# EAGLE design Lokalizator.GPS.GSM_Michał.Figołuszka (EAGLE 9.6.2)
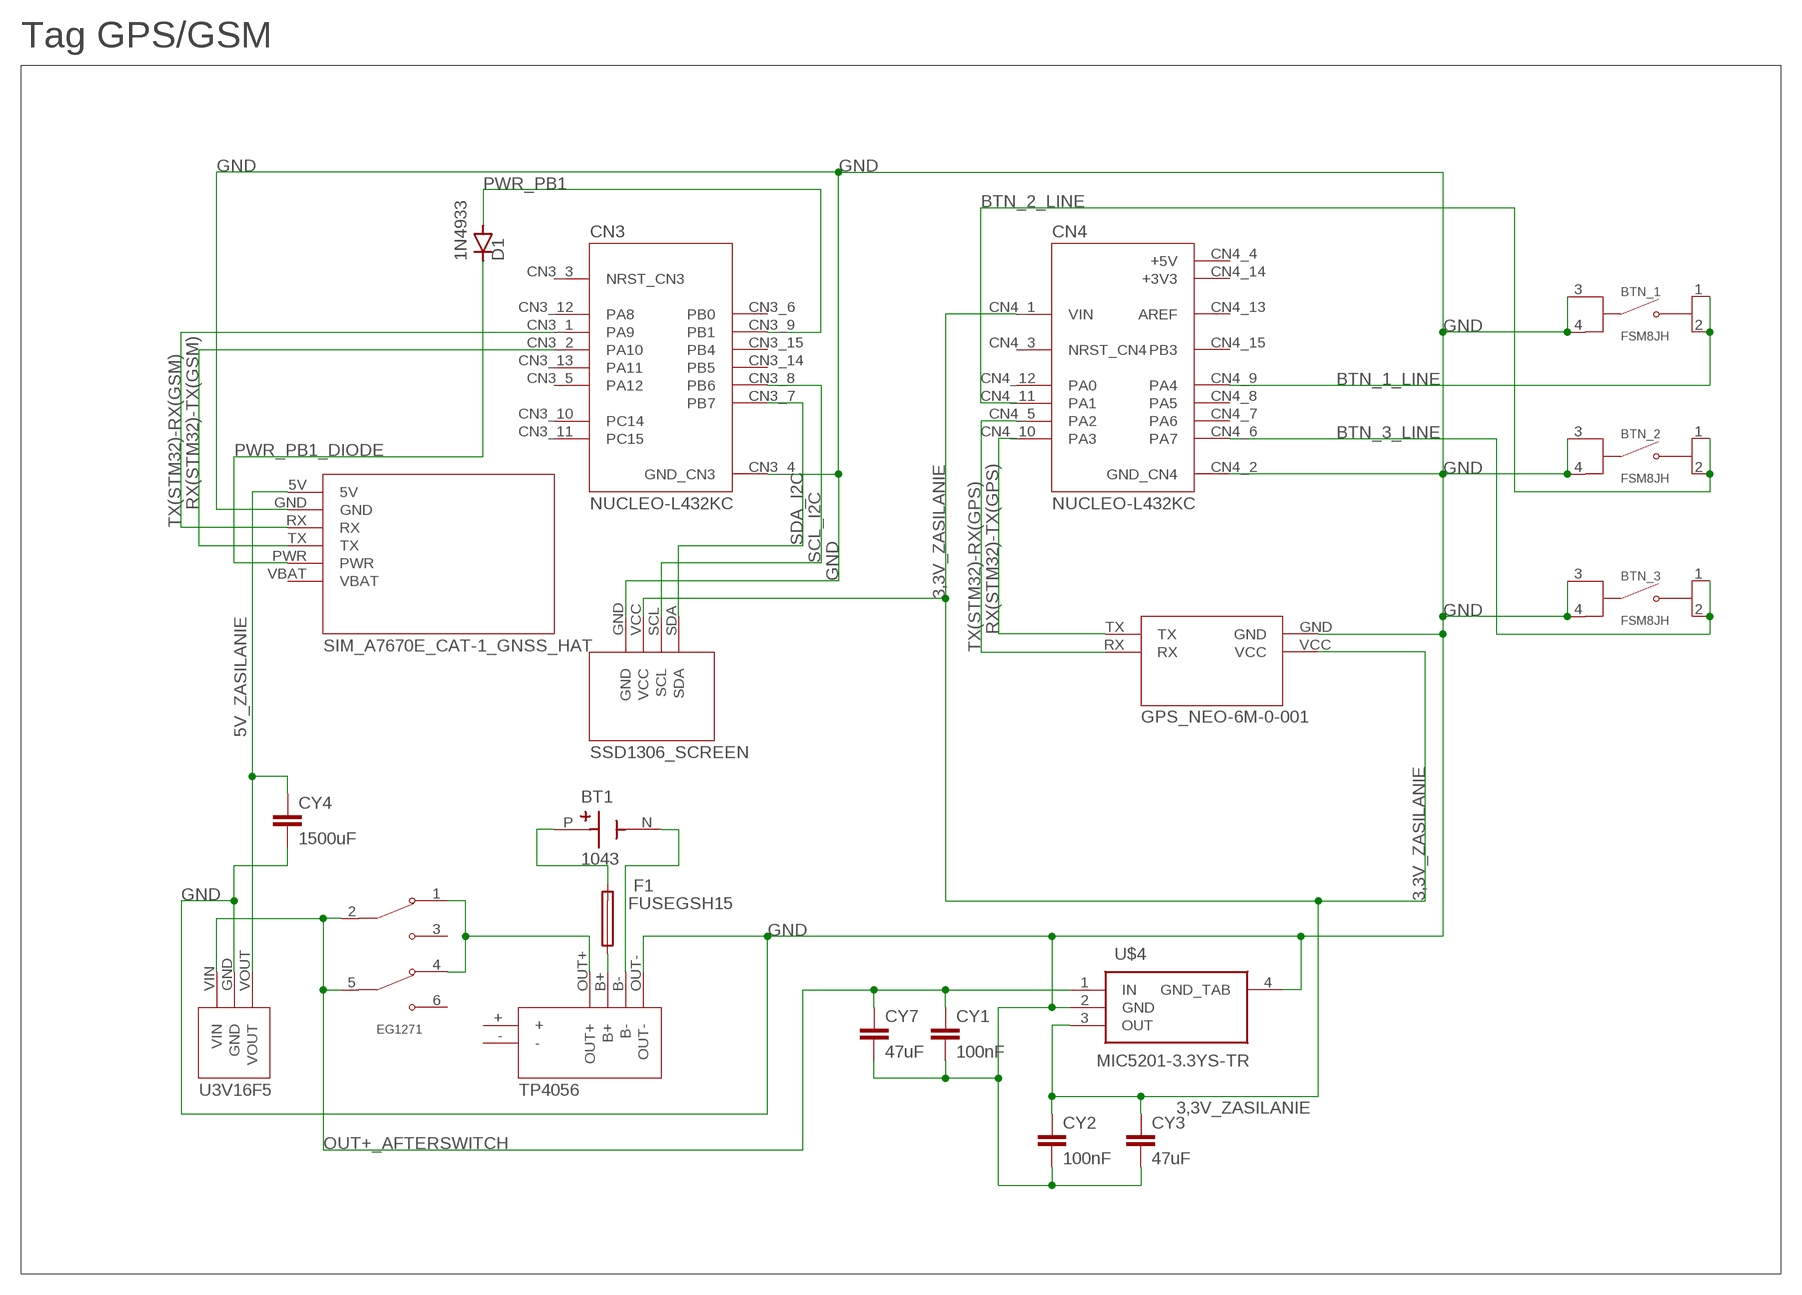
[diagram p0: schematic, sheet 1]

## Parts
BT1  1043  [BAT_1043]
BTN_1  FSM8JH  [SW_FSM8JH]
BTN_2  FSM8JH  [SW_FSM8JH]
BTN_3  FSM8JH  [SW_FSM8JH]
CY1  100nF  CYYC7B5  [YC7B5]
CY2  100nF  CYYC7B5  [YC7B5]
CY3  47uF  CYYC7B5  [YC7B5]
CY4  1500uF  CYYC7B5  [YC7B5]
CY7  47uF  CYYC7B5  [YC7B5]
D1  1N4933  [DO41-10]
F1  FUSEGSH15  [GSH15]
S1  EG1271  [SW_EG1271]
U1  NUCLEO-L432KC  [MODULE_NUCLEO-L432KC]
U$1  U3V16F5  [U3V16F5]
U$2  TP4056  [TP4056]
U$3  SSD1306_SCREEN  [SSD1306_SCREEN]
U$4  MIC5201-3.3YS-TR  [SOT230P700X180-4N]
U$6  SIM7020E_NB-IOT_HAT  [SIM7020E_NB-IOT_HAT]
U$7  GPS_NEO-6M-0-001  [GPS_NEO-6M-0-001]

## Nets
3,3V_ZASILANIE: CY2.1 CY3.1 U1.CN4_1(VIN) U$3.VCC U$4.3(OUT) U$7.VCC
5V_ZASILANIE: CY4.1 U$1.VOUT U$6.5V
B+: BT1.P(POS) F1.2
B+_2: F1.1 U$2.B+
B-: BT1.N(NEG) U$2.B-
BTN_1_LINE: BTN_1.1(NO_1) BTN_1.2(NO_2) U1.CN4_9(PA4)
BTN_2_LINE: BTN_2.1(NO_1) BTN_2.2(NO_2) U1.CN4_11(PA1)
BTN_3_LINE: BTN_3.1(NO_1) BTN_3.2(NO_2) U1.CN4_6(PA7)
GND: BTN_1.3(COM_3) BTN_1.4(COM_4) BTN_2.3(COM_3) BTN_2.4(COM_4) BTN_3.3(COM_3) BTN_3.4(COM_4) CY1.2 CY2.2 CY3.2 CY4.2 CY7.2 U1.CN3_4(GND_CN3) U1.CN4_2(GND_CN4) U$1.GND U$2.OUT- U$3.GND U$4.2(GND) U$4.4(GND_TAB) U$6.GND U$7.GND
OUT+: S1.1(NC1) S1.4(NC2) U$2.OUT+
OUT+_AFTERSWITCH: CY1.1 CY7.1 S1.2(COM1) S1.5(COM2) U$1.VIN U$4.1(IN)
PWR_PB1: D1.A U1.CN3_9(PB1)
PWR_PB1_DIODE: D1.C U$6.PWR
RX(STM32)-TX(GPS): U1.CN4_10(PA3) U$7.TX
RX(STM32)-TX(GSM): U1.CN3_2(PA10) U$6.TX
SCL_I2C: U1.CN3_8(PB6) U$3.SCL
SDA_I2C: U1.CN3_7(PB7) U$3.SDA
TX(STM32)-RX(GPS): U1.CN4_5(PA2) U$7.RX
TX(STM32)-RX(GSM): U1.CN3_1(PA9) U$6.RX
Unconnected: S1.3(NO1) S1.6(NO2) U1.CN3_3(NRST_CN3) U1.CN3_5(PA12) U1.CN3_6(PB0) U1.CN3_10(PC14) U1.CN3_11(PC15) U1.CN3_12(PA8) U1.CN3_13(PA11) U1.CN3_14(PB5) U1.CN3_15(PB4) U1.CN4_3(NRST_CN4) U1.CN4_7(PA6) U1.CN4_8(PA5) U1.CN4_12(PA0) U1.CN4_13(AREF) U1.CN4_15(PB3) U$2.+ U$2.- U$6.VBAT

## Notes on the sheet
- Tag GPS/GSM

## Power pins joined to a net without a drawn wire
+3V3: U1.CN4_14(+3V3)
+5V: U1.CN4_4(+5V)

## Library data of the parts
BT1 = holder_1043:1043: Check availability <https://pricing.snapeda.com/parts/1043/Keystone%20Electronics/view-part?ref=eda>; AVAILABILITY: In Stock; CHECK_PRICES: https://www.snapeda.com/parts/1043/Keystone/view-part/?ref=eda; DESCRIPTION: THM Holder for 18650 Battery; MF: Keystone Electronics; MP: 1043; PACKAGE: NON STANDARD-5 Keystone; PRICE: None; SNAPEDA_LINK: https://www.snapeda.com/parts/1043/Keystone/view-part/?ref=snap
BTN_1-BTN_3 = FSM8JH_button:FSM8JH: Check availability <https://pricing.snapeda.com/parts/FSM8JH/TE%20Connectivity/view-part?ref=eda>; AVAILABILITY: In Stock; CHECK_PRICES: https://www.snapeda.com/parts/FSM8JH/TE+Connectivity+Alcoswitch+Switches/view-part/?ref=eda; DESCRIPTION: Switch,Pushbutton,Tactile,SPST,Thru Hole,Vertical,6MM,Black | TE Connectivity FSM8JH; MF: TE Connectivity; MP: FSM8JH; PACKAGE: None; PRICE: None; SNAPEDA_LINK: https://www.snapeda.com/parts/FSM8JH/TE+Connectivity+Alcoswitch+Switches/view-part/?ref=snap
CY1-CY4 CY7 = rcl:CY: Y CAPACITOR for power line; SPICEPREFIX: C
D1 = diode:1N4933: DIODE fast recovery rectifier, 1A
F1 = fuse:FUSE: Fuse; OC_FARNELL: unknown; OC_NEWARK: unknown
S1 = EG1271_switch:EG1271: Check availability <https://pricing.snapeda.com/parts/EG1271/E-Switch/view-part?ref=eda>; AVAILABILITY: In Stock; CHECK_PRICES: https://www.snapeda.com/parts/EG1271/E-Switch/view-part/?ref=eda; DESCRIPTION: Slide Switch SPDT Through Hole; MF: E-Switch; MP: EG1271; PACKAGE: None; PRICE: None; SNAPEDA_LINK: https://www.snapeda.com/parts/EG1271/E-Switch/view-part/?ref=snap
U1 = NUCLEO-L432KC:NUCLEO-L432KC: Check availability <https://pricing.snapeda.com/parts/NUCLEO-L432KC/STMicroelectronics/view-part?ref=eda>; AVAILABILITY: In Stock; CHECK_PRICES: https://www.snapeda.com/parts/NUCLEO-L432KC/STMicroelectronics/view-part/?ref=eda; DESCRIPTION: STM32L432KC, mbed-Enabled Development Nucleo-32 STM32L4 ARM® Cortex®-M4 MCU 32-Bit Embedded Evaluation Board; MF: STMicroelectronics; MP: NUCLEO-L432KC; PACKAGE: None; PRICE: None; SNAPEDA_LINK: https://www.snapeda.com/parts/NUCLEO-L432KC/STMicroelectronics/view-part/?ref=snap
U$1 = U3V16F5:U3V16F5
U$2 = TP4056:TP4056
U$3 = SSD1306_SCREEN:SSD1306_SCREEN
U$4 = MIC5201-3.3YS-TR:MIC5201-3.3YS-TR
U$6 = SIM_A7670E_CAT-1_GNSS_HAT:SIM7020E_NB-IOT_HAT
U$7 = GPS_NEO-6M-0-001:GPS_NEO-6M-0-001

## Board
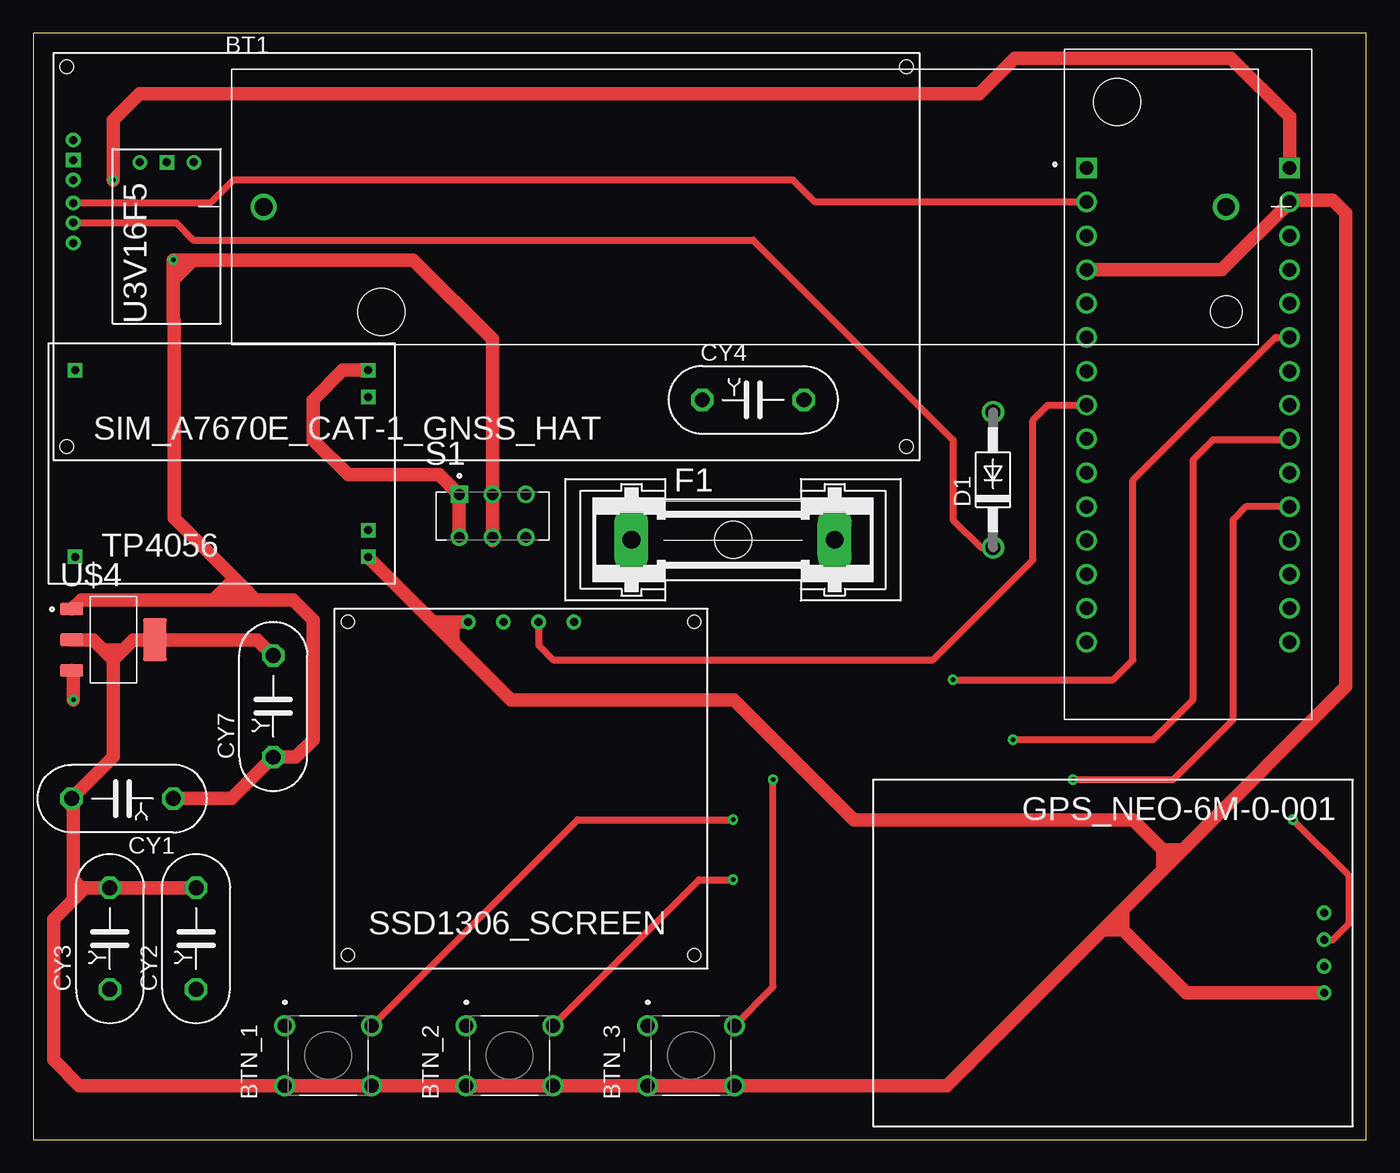
[diagram p1: board, top side]
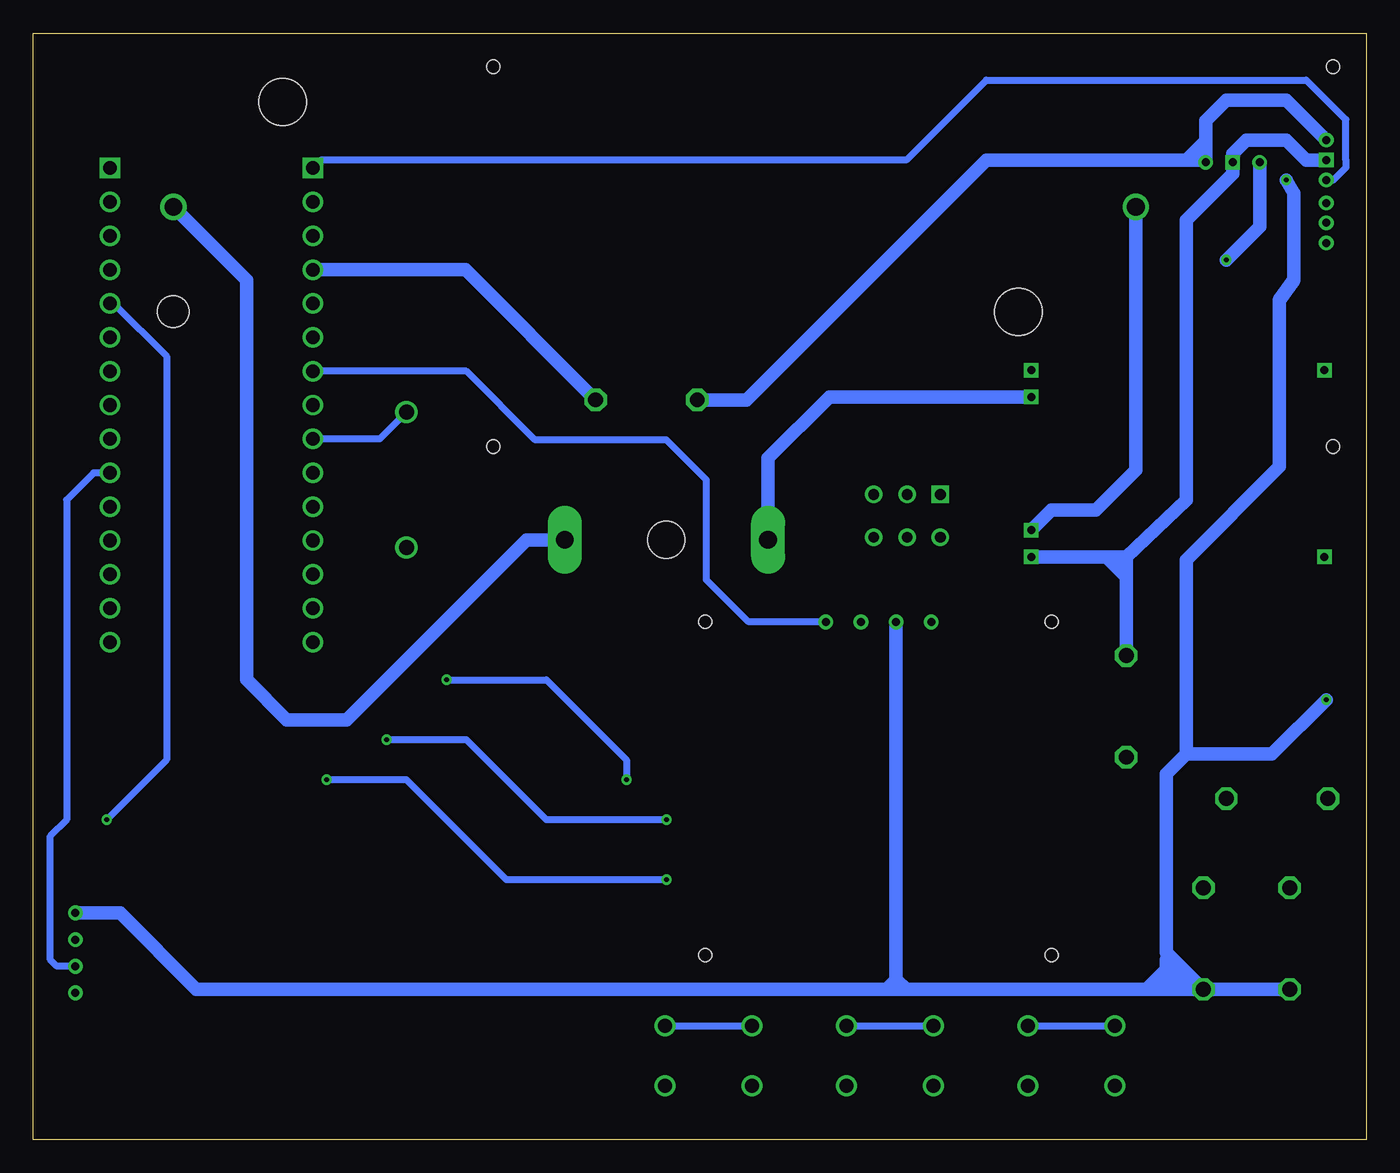
[diagram p2: board, bottom side, seen from below]

Size 100 x 83 mm. Coordinates in mm from the lower left corner, seen from the top.
Outline: 0,0 100,0 100,83 0,83 0,0
Copper layers (1*16): Top 0.035mm / dielectric 1.5mm / Bottom 0.035mm
Design rules "default": minimum track width 6mil, minimum drill 0.35mm, track to track 6mil, track to pad 6mil, pad to pad 6mil, via to via 6mil, smd to smd 6mil, copper to edge 40mil, drill to drill 6mil, minimum pad ring 10mil, minimum via ring 8mil, stop-mask expansion 4mil, vias tented up to drill 0mil, thermal gap 10mil

### Footprints (pad centres in the part's own frame; a part is rotated, then mirrored left to right if it is on the bottom)
BAT_1043 = drill 1.32: N -36.11,0; P 36.11,0 | hole 3.55: 27.91,7.87; -27.29,-7.87 | hole 2.39: 36.11,-7.87
SW_FSM8JH = drill 1.05: 1 2.25,3.25; 2 2.25,-3.25; 3 -2.25,3.25; 4 -2.25,-3.25
YC7B5 = drill 1.118 octagon: 1 -3.81,0; 2 3.81,0
DO41-10 = drill 1.118: A 5.08,0; C -5.08,0
GSH15 = drill 1.321 pad 2.54 long: 1 -7.62,0; 2 7.62,0 | hole 2.794: 0,0
SW_EG1271 = drill 0.8 square: 1 -2.5,1.6 | drill 0.8: 2 0,1.6; 3 2.5,1.6; 4 -2.5,-1.6; 5 0,-1.6; 6 2.5,-1.6
MODULE_NUCLEO-L432KC = drill 1.02 square: CN3_1 -7.62,16.215; CN4_1 7.62,16.215 | drill 1.02: CN3_2 -7.62,13.675; CN3_3 -7.62,11.135; CN3_4 -7.62,8.595; CN3_5 -7.62,6.055; CN3_6 -7.62,3.515; CN3_7 -7.62,0.975; CN3_8 -7.62,-1.565; CN3_9 -7.62,-4.105; CN3_10 -7.62,-6.645; CN3_11 -7.62,-9.185; CN3_12 -7.62,-11.725; CN3_13 -7.62,-14.265; CN3_14 -7.62,-16.805; CN3_15 -7.62,-19.345; CN4_2 7.62,13.675; CN4_3 7.62,11.135; CN4_4 7.62,8.595; CN4_5 7.62,6.055; CN4_6 7.62,3.515; CN4_7 7.62,0.975; CN4_8 7.62,-1.565; CN4_9 7.62,-4.105; CN4_10 7.62,-6.645; CN4_11 7.62,-9.185; CN4_12 7.62,-11.725; CN4_13 7.62,-14.265; CN4_14 7.62,-16.805; CN4_15 7.62,-19.345
U3V16F5 = drill 0.6 square: GND 4.05,12.1 | drill 0.6: VIN 2.025,12.1; VOUT 6.075,12.1
TP4056 = drill 0.6 square: + 2,16; - 2,2; B+ 24,14; B- 24,4; OUT+ 24,16; OUT- 24,2
SSD1306_SCREEN = drill 0.6: GND 10.04,26; SCL 15.32,26; SDA 17.96,26; VCC 12.68,26 | hole 1: 1,26; 27,26; 27,1; 1,1
SOT230P700X180-4N = smd 1.76 x 0.93: 1 -3.125,2.3; 2 -3.125,0; 3 -3.125,-2.3 | smd 1.76 x 3.19: 4 3.125,0
SIM7020E_NB-IOT_HAT = drill 0.6: 5V 1.5,24; PWR 1.5,17.78; RX 1.5,21; TX 1.5,19.27; VBAT 1.5,16.27 | drill 0.6 square: GND 1.5,22.5 | hole 1: 1,29.5; 64,29.5; 64,1; 1,1
GPS_NEO-6M-0-001 = drill 0.6: GND 2.16,16; RX 2.16,12; TX 2.16,14; VCC 2.16,10

### Placement (x,y rotation side)
BT1  53.39,69.98 0 top
BTN_1  22.12,6.3 90 top
BTN_2  35.73,6.3 90 top
BTN_3  49.34,6.3 90 top
CY1  6.68,25.58 180 top
CY2  12.21,15.08 90 top
CY3  5.74,15.08 90 top
CY4  54,55.5 0 top
CY7  18,32.5 90 top
D1  72,49.5 90 top
F1  52.5,45 0 top
S1  34.45,46.8 0 top
U1  86.64,56.67 0 top
U$1  5.97,61.22 0 top
U$2  1.13,41.72 0 top
U$3  22.59,12.84 0 top
U$4  6,37.5 0 top
U$6  1.5,51 0 top
U$7  99,27 180 top

### Tracks (layer width: path | path; a pad name or v marks a point on that pad's centre or on a via)
3,3V_ZASILANIE  (via drill 0.35)
  Top 1.016: U1.CN4_1 94.26,76.74 89.85,81.15 73.65,81.15 70.98,78.48 7.98,78.48 6,76.5 v6,72 | U$4.3 3,35.08 v3,33
  Bottom 1.016: 13.5,28.93 7.07,28.93 v3,33 | v6,72 5.42,71.02 5.42,64.5 6.52,63 6.52,50.48 13.5,43.5 13.5,28.93 | CY2.1 CY3.1 | U$7.VCC 93.5,17 87.77,11.27 36,11.27 | CY2.1 13.5,11.27 | 14.27,11.27 15,11.27 | 34.5,11.27 16.5,11.27 | 15.73,11.27 15,11.27 | 34.5,11.27 36,11.27 | 13.5,28.93 15,27.43 15,14.06 14.72,13.78 | CY2.1 13.22,12.28 | 14.72,13.78 13.97,13.03 | 13.97,13.03 13.22,12.28 | U$3.VCC 35.27,12 | 35.27,12 36,11.27 | 34.5,11.27 35.23,12 35.27,12 | 13.22,12.28 13.5,12 | 13.5,11.27 13.5,12 | 14.72,13.78 15,13.5 | 15,12.77 15,12 | 13.97,13.03 15,12 | 15,12 15,11.27 | 14.27,11.27 14.23,11.27 | 14.23,11.27 13.5,12 | 13.5,11.27 14.23,11.27 | 14.27,11.27 15,12 | 15,13.5 13.5,12 | 13.5,12 15,12 | 15,12 15.73,11.27 | 15.73,11.27 16.5,11.27 | 16.5,11.27 15,12.77 | 15,12.77 15,13.5
5V_ZASILANIE
  Bottom 1.016: U$6.5V 6,78 10.5,78 12.04,76.45 12.04,75 12.04,74.95 | 12.04,74.95 U$1.VOUT 12.22,73.5 13.5,73.5 | CY4.1 46.5,55.5 28.5,73.5 13.5,73.5 | 13.5,73.5 12.04,74.95
B+
  Bottom 1.016: BT1.P 84.01,64.49 84.01,34.51 81,31.5 76.5,31.5 63,45 F1.2
B+_2
  Bottom 1.016: U$2.B+ 40.28,55.72 44.88,51.12 F1.1
B-
  Bottom 1.016: BT1.N 17.28,50.22 20.28,47.22 23.63,47.22 U$2.B-
BTN_1_LINE  (via drill 0.35)
  Top 0.508: U1.CN4_9 94.19,52.5 88.5,52.5 87,51 87,33 84,30 v73.5,30 | BTN_1.2 40.82,24 v52.5,24
  Bottom 0.508: BTN_1.2 BTN_1.1 | v73.5,30 67.5,30 61.5,24 v52.5,24
BTN_2_LINE  (via drill 0.35)
  Top 0.508: U1.CN4_11 90.98,47.48 90,46.5 90,31.5 85.5,27 v78,27 | BTN_2.2 49.93,19.5 v52.5,19.5
  Bottom 0.508: BTN_2.2 BTN_2.1 | v78,27 72,27 64.5,19.5 v52.5,19.5
BTN_3_LINE  (via drill 0.35)
  Top 0.508: v69,34.5 81,34.5 82.5,36 82.5,49.5 93.19,60.19 U1.CN4_6 | BTN_3.2 55.5,11.46 v55.5,27
  Bottom 0.508: BTN_3.2 BTN_3.1 | v69,34.5 61.5,34.5 55.5,28.5 v55.5,27
GND
  Top 1.016: 3,19.5 3,25.45 CY1.2 6,28.71 6,36 | 3,19.5 3.61,18.89 3.89,18.89 | 3.89,18.89 CY3.2 CY2.2 | U1.CN3_4 89.18,65.27 U1.CN4_2 94.42,70.5 97.5,70.5 98.48,69.52 98.48,33.98 86.25,21.75 | 6,36 5.25,36.75 | 5.25,36.75 4.5,37.5 U$4.2 | 6,36 6.75,36.75 | 6.75,36.75 7.5,37.5 U$4.4 16.81,37.5 CY7.2 | 80.25,15.75 68.55,4.05 BTN_3.4 BTN_3.3 BTN_2.4 BTN_2.3 BTN_1.4 BTN_1.3 3.45,4.05 1.52,5.98 1.52,16.52 3,18 | 80.25,15.75 81,16.5 | 81,16.5 81.75,17.25 | 81.75,17.25 84.75,20.25 | 84.75,20.25 85.5,21 | 85.5,21 86.25,21.75 | U$7.GND 86.5,11 81.75,15.75 | 81.75,15.75 81,16.5 | 81.75,15.75 81.75,17.25 | 80.25,15.75 81.75,15.75 | 3,19.5 3,18 | 3,18 3.89,18.89 | U$2.OUT- 30.01,38.84 | 30.01,38.84 31.5,38.84 | 31.5,38.84 U$3.GND | 84.75,21.75 82.5,24 61.57,24 52.57,33 35.85,33 31.43,37.42 | 85.5,21 84.75,21.75 | 84.75,21.75 86.25,21.75 | 84.75,21.75 84.75,20.25 | 30.01,38.84 31.43,37.42 | 31.5,38.84 31.5,37.5 31.43,37.42 | 5.25,36.75 6.75,36.75
  Bottom 1.016: 18,43.7 13.5,48 13.5,69 10.02,72.48 U$1.GND 10.02,73.98 9,75 6,75 4.5,73.5 U$6.GND | 18,43.7 19.5,43.7 | 19.5,43.7 24.91,43.7 U$2.OUT- | CY4.2 67.58,65.27 U1.CN3_4 | CY7.2 18,42 18,42.2 | 18,42.2 18,43.7 | 19.5,43.7 18,42.2
OUT+
  Top 1.016: U$2.OUT+ 23.22,57.72 21,55.5 21,52.5 23.6,49.9 30.45,49.9 S1.1 S1.4
OUT+_AFTERSWITCH  (via drill 0.35)
  Top 1.016: 12,66 28.5,66 34.45,60.05 S1.2 S1.5 34.45,44.95 | 10.5,64.5 10.5,61.5 10.57,61.43 10.57,46.62 15.1,42.09 | 12,66 10.5,64.5 | 10.5,64.5 v10.5,66 12,66 | 15.85,41.34 16.69,40.5 | 15.85,41.34 15.1,42.09 | U$4.1 3.58,40.5 13.5,40.5 | 13.5,40.5 15,40.5 | 15.1,40.59 15.85,41.34 | 15,40.5 16.69,40.5 | CY1.1 14.89,25.58 CY7.1 19.69,28.69 21,30 21,39 19.5,40.5 16.69,40.5 | 15,40.5 15.1,40.59 | 15.1,40.59 15.1,42.09 | 15.1,42.09 13.5,40.5
  Bottom 1.016: v10.5,66 8,68.5 U$1.VIN
PWR_PB1
  Bottom 0.508: D1.A 74.02,52.56 U1.CN3_9
PWR_PB1_DIODE
  Top 0.508: U$6.PWR 10.72,68.78 12,67.5 54,67.5 69,52.5 69,46.5 71.08,44.42 D1.C
RX(STM32)-TX(GPS)
  Bottom 0.508: U1.CN4_10 95.47,50.02 97.5,48 97.5,24 98.73,22.77 98.73,13.5 98.23,13 U$7.TX
RX(STM32)-TX(GSM)
  Top 0.508: U1.CN3_2 58.66,70.34 57,72 15,72 13.27,70.27 U$6.TX
SCL_I2C
  Top 0.508: U1.CN3_8 76.11,55.1 75,54 75,43.5 67.5,36 39,36 37.91,37.09 U$3.SCL
SDA_I2C
  Bottom 0.508: U1.CN3_7 67.5,57.65 62.35,52.5 52.5,52.5 49.5,49.5 49.5,42 46.34,38.84 U$3.SDA 40.66,38.84
TX(STM32)-RX(GPS)  (via drill 0.35)
  Top 0.508: U$7.RX 97.5,15 98.73,16.23 98.73,19.77 v94.5,24
  Bottom 0.508: U1.CN4_5 93.96,62.73 90,58.77 90,28.5 v94.5,24
TX(STM32)-RX(GSM)
  Bottom 0.152: 1.52,73.5 1.52,73.48
  Bottom 0.508: U$6.RX 2.46,72 1.52,72.93 1.52,73.5 1.52,76.52 4.5,79.5 28.5,79.5 34.5,73.5 78.41,73.5 U1.CN3_1